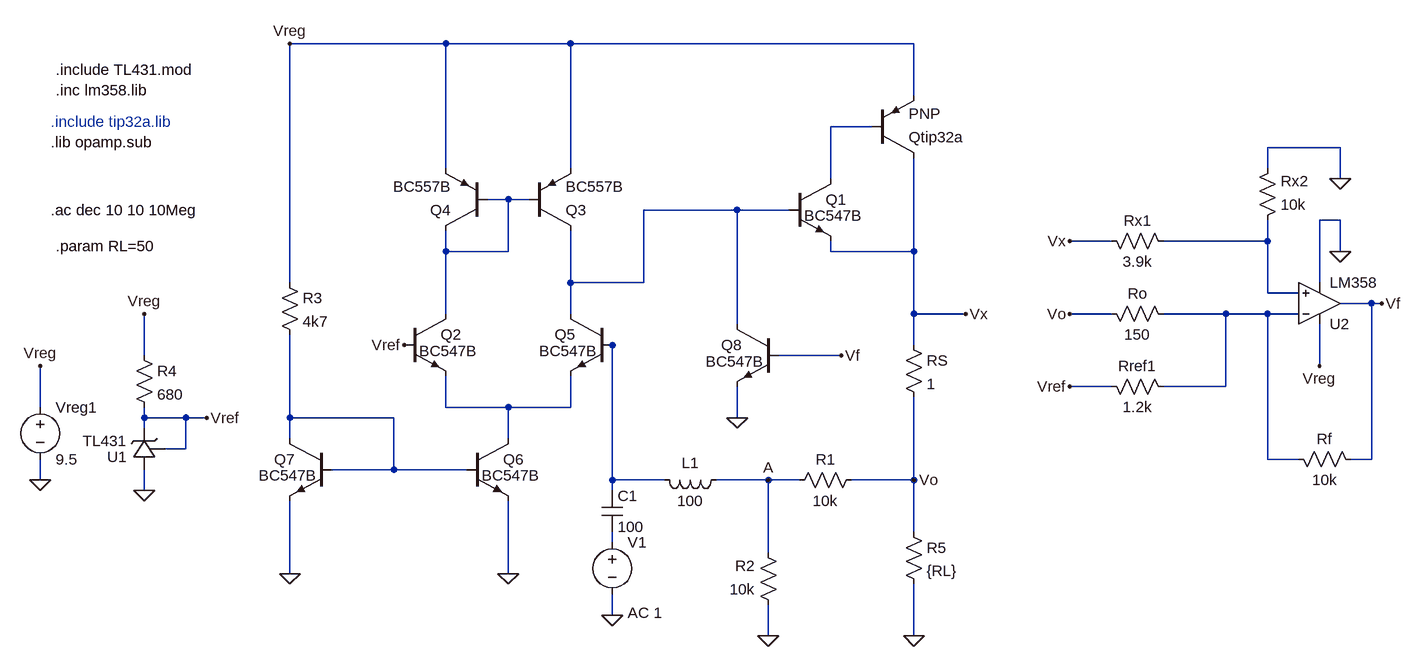
[diagram p0: schematic Ganancia de Lazo.asc]
Ganancia de Lazo.asc, the LTspice schematic file:
Version 4
SHEET 1 1880 680
WIRE 32 -288 -208 -288
WIRE 224 -288 32 -288
WIRE 752 -288 224 -288
WIRE 752 -208 752 -288
WIRE 688 -160 624 -160
WIRE 1408 -128 1296 -128
WIRE 32 -96 32 -288
WIRE 224 -96 224 -288
WIRE 1296 -96 1296 -128
WIRE 624 -80 624 -160
WIRE 1408 -80 1408 -128
WIRE 128 -48 96 -48
WIRE 160 -48 128 -48
WIRE 480 -32 336 -32
WIRE 560 -32 480 -32
WIRE 1408 -16 1376 -16
WIRE 1056 16 992 16
WIRE 1296 16 1296 -16
WIRE 1296 16 1136 16
WIRE 32 32 32 0
WIRE 128 32 128 -48
WIRE 128 32 32 32
WIRE 624 32 624 16
WIRE 752 32 752 -112
WIRE 752 32 624 32
WIRE 1408 32 1408 -16
WIRE -208 80 -208 -288
WIRE 224 80 224 0
WIRE 336 80 336 -32
WIRE 336 80 224 80
WIRE 1376 80 1376 -16
WIRE 1296 96 1296 16
WIRE 1344 96 1296 96
WIRE 1456 112 1408 112
WIRE 1472 112 1456 112
WIRE 32 128 32 32
WIRE 224 128 224 80
WIRE 752 128 752 32
WIRE 832 128 752 128
WIRE 1056 128 992 128
WIRE 1232 128 1136 128
WIRE 1296 128 1232 128
WIRE 1344 128 1296 128
WIRE 480 144 480 -32
WIRE 288 176 272 176
WIRE 752 176 752 128
WIRE -432 192 -432 128
WIRE 640 192 544 192
WIRE 1376 208 1376 144
WIRE 1056 240 992 240
WIRE 1232 240 1232 128
WIRE 1232 240 1136 240
WIRE -592 272 -592 208
WIRE 32 272 32 224
WIRE 128 272 32 272
WIRE 224 272 224 224
WIRE 224 272 128 272
WIRE -432 288 -432 272
WIRE -368 288 -432 288
WIRE -336 288 -368 288
WIRE -208 288 -208 160
WIRE -48 288 -208 288
WIRE 480 288 480 240
WIRE -432 304 -432 288
WIRE -208 320 -208 288
WIRE 128 320 128 272
WIRE -368 336 -368 288
WIRE -368 336 -400 336
WIRE 1296 352 1296 128
WIRE 1344 352 1296 352
WIRE 1456 352 1456 112
WIRE 1456 352 1424 352
WIRE -48 368 -48 288
WIRE -48 368 -144 368
WIRE 64 368 -48 368
WIRE -592 384 -592 352
WIRE 288 384 288 176
WIRE 368 384 288 384
WIRE 528 384 448 384
WIRE 576 384 528 384
WIRE 752 384 752 256
WIRE 752 384 656 384
WIRE -432 400 -432 368
WIRE 288 400 288 384
WIRE 752 464 752 384
WIRE 288 480 288 464
WIRE 528 496 528 384
WIRE -208 528 -208 416
WIRE 128 528 128 416
WIRE 288 592 288 560
WIRE 528 624 528 576
WIRE 752 624 752 544
FLAG 128 528 0
FLAG -208 528 0
FLAG 528 624 0
FLAG -32 176 Vref
FLAG -592 384 0
FLAG -592 208 Vreg
FLAG -208 -288 Vreg
FLAG 752 384 Vo
FLAG 832 128 Vx
FLAG -432 400 0
FLAG -336 288 Vref
FLAG -432 128 Vreg
FLAG 288 592 0
FLAG 752 624 0
FLAG 480 288 0
FLAG 1472 112 Vf
FLAG 992 240 Vref
FLAG 992 128 Vo
FLAG 992 16 Vx
FLAG 1376 208 Vreg
FLAG 640 192 Vf
FLAG 1408 -80 0
FLAG 1408 32 0
FLAG 528 384 A
SYMBOL npn -32 128 R0
WINDOW 3 23 57 Left 2
SYMATTR Value BC547B
SYMATTR InstName Q2
SYMBOL pnp 96 0 R180
SYMATTR InstName Q4
SYMATTR Value BC557B
SYMBOL res 672 368 R90
WINDOW 0 0 56 VBottom 2
WINDOW 3 32 56 VTop 2
SYMATTR InstName R1
SYMATTR Value 10k
SYMBOL res 544 592 R180
WINDOW 0 36 76 Left 2
WINDOW 3 36 40 Left 2
SYMATTR InstName R2
SYMATTR Value 10k
SYMBOL res -224 64 R0
SYMATTR InstName R3
SYMATTR Value 4k7
SYMBOL voltage -592 256 R0
WINDOW 123 0 0 Left 0
WINDOW 39 0 0 Left 0
SYMATTR InstName Vreg1
SYMATTR Value 9.5
SYMBOL pnp 688 -112 M180
SYMATTR InstName Qtip32a
SYMBOL res 736 160 R0
SYMATTR InstName RS
SYMATTR Value 1
SYMBOL pnp 160 0 M180
SYMATTR InstName Q3
SYMATTR Value BC557B
SYMBOL npn 288 128 M0
WINDOW 3 23 57 Left 2
SYMATTR Value BC547B
SYMATTR InstName Q5
SYMBOL npn 64 320 R0
WINDOW 3 23 57 Left 2
SYMATTR Value BC547B
SYMATTR InstName Q6
SYMBOL npn -144 320 M0
WINDOW 3 23 57 Left 2
SYMATTR Value BC547B
SYMATTR InstName Q7
SYMBOL npn 560 -80 R0
WINDOW 3 23 57 Left 2
SYMATTR Value BC547B
SYMATTR InstName Q1
SYMBOL res -448 176 R0
SYMATTR InstName R4
SYMATTR Value 680
SYMBOL TL431 -416 368 R180
SYMATTR InstName U1
SYMBOL voltage 288 464 R0
WINDOW 123 24 124 Left 2
WINDOW 39 0 0 Left 0
SYMATTR Value2 AC 1
SYMATTR InstName V1
SYMATTR Value ""
SYMBOL cap 272 400 R0
SYMATTR InstName C1
SYMATTR Value 100
SYMBOL ind 464 368 R90
WINDOW 0 5 56 VBottom 2
WINDOW 3 32 56 VTop 2
SYMATTR InstName L1
SYMATTR Value 100
SYMBOL res 736 448 R0
SYMATTR InstName R5
SYMATTR Value {RL}
SYMBOL npn 544 144 M0
WINDOW 3 23 57 Left 2
SYMATTR Value BC547B
SYMATTR InstName Q8
SYMBOL res 1440 368 M270
WINDOW 0 32 56 VTop 2
WINDOW 3 0 56 VBottom 2
SYMATTR InstName Rf
SYMATTR Value 10k
SYMBOL res 1152 256 M270
WINDOW 0 32 56 VTop 2
WINDOW 3 0 56 VBottom 2
SYMATTR InstName Rref1
SYMATTR Value 1.2k
SYMBOL res 1152 144 M270
WINDOW 0 32 56 VTop 2
WINDOW 3 0 56 VBottom 2
SYMATTR InstName Ro
SYMATTR Value 150
SYMBOL res 1152 32 M270
WINDOW 0 32 56 VTop 2
WINDOW 3 0 56 VBottom 2
SYMATTR InstName Rx1
SYMATTR Value 3.9k
SYMBOL res 1280 0 M180
WINDOW 0 36 76 Left 2
WINDOW 3 36 40 Left 2
SYMATTR InstName Rx2
SYMATTR Value 10k
SYMBOL OpAmps\\opamp2 1376 176 M180
SYMATTR InstName U2
SYMATTR Value LM358
TEXT -576 -168 Left 2 ;.include tip32a.lib
TEXT -576 -136 Left 2 !.lib opamp.sub
TEXT -568 -216 Left 2 !.inc lm358.lib
TEXT -568 -248 Left 2 !.include TL431.mod
TEXT -576 -32 Left 2 !.ac dec 10 10 10Meg
TEXT -568 24 Left 2 !.param RL=50

The netlist it stands for:
* Ganancia de Lazo.asc
Q2 N002 Vref N007 0 BC547B
Q4 N002 N002 Vreg 0 BC557B
R1 Vo A 10k
R2 0 A 10k
R3 Vreg N008 4k7
Vreg1 Vreg 0 9.5
Qtip32a Vx N001 Vreg 0 PNP
RS Vx Vo 1
Q3 N003 N002 Vreg 0 BC557B
Q5 N003 N006 N007 0 BC547B
Q6 N007 N008 0 0 BC547B
Q7 N008 N008 0 0 BC547B
Q1 N001 N003 Vx 0 BC547B
R4 Vreg Vref 680
XU1 0 Vref Vref TL431 TL431 TL431  ; pins A K ref
V1 N009 0 AC 1
C1 N006 N009 100
L1 A N006 100
R5 Vo 0 {RL}
Q8 N003 Vf 0 0 BC547B
Rf Vf N005 10k
Rref1 N005 Vref 1.2k
Ro N005 Vo 150
Rx1 N004 Vx 3.9k
Rx2 N004 0 10k
XU2 N004 N005 Vreg 0 Vf LM358  ; pins In+ In- V+ V- OUT
.model NPN NPN
.model PNP PNP
.lib standard.bjt
* .include tip32a.lib
.lib opamp.sub
.inc lm358.lib
.include TL431.mod
.ac dec 10 10 10Meg
.param RL=50
.lib TL431.mod
.backanno
.end